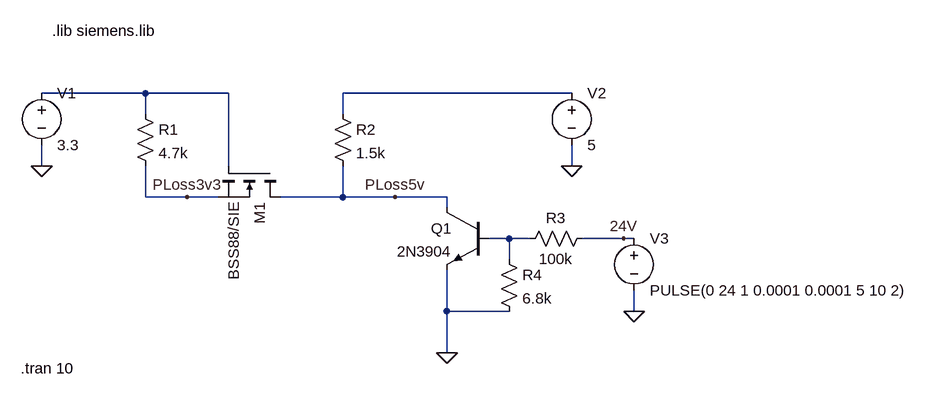
[diagram p0: schematic LevelShifter.asc]
LevelShifter.asc, the LTspice schematic file:
Version 4
SHEET 1 1572 680
WIRE -128 0 -288 0
WIRE 0 0 -128 0
WIRE 528 0 176 0
WIRE -128 32 -128 0
WIRE 176 32 176 0
WIRE -288 112 -288 80
WIRE 0 112 0 0
WIRE 528 112 528 80
WIRE -128 160 -128 112
WIRE -64 160 -128 160
WIRE -16 160 -64 160
WIRE 176 160 176 112
WIRE 176 160 80 160
WIRE 256 160 176 160
WIRE 336 160 256 160
WIRE 336 176 336 160
WIRE 432 224 400 224
WIRE 464 224 432 224
WIRE 608 224 544 224
WIRE 624 224 608 224
WIRE 432 256 432 224
WIRE 336 336 336 272
WIRE 432 336 336 336
WIRE 624 336 624 304
WIRE 336 400 336 336
FLAG 336 400 0
FLAG -288 112 0
FLAG 528 112 0
FLAG 624 336 0
FLAG -64 160 PLoss3v3
FLAG 256 160 PLoss5v
FLAG 608 224 24V
SYMBOL voltage -288 -16 R0
WINDOW 123 0 0 Left 0
WINDOW 39 0 0 Left 0
SYMATTR InstName V1
SYMATTR Value 3.3
SYMBOL voltage 528 -16 R0
WINDOW 123 0 0 Left 0
WINDOW 39 0 0 Left 0
SYMATTR InstName V2
SYMATTR Value 5
SYMBOL voltage 624 208 R0
WINDOW 123 0 0 Left 0
WINDOW 39 0 0 Left 0
SYMATTR InstName V3
SYMATTR Value PULSE(0 24 1 0.0001 0.0001 5 10 2)
SYMBOL npn 400 176 M0
SYMATTR InstName Q1
SYMATTR Value 2N3904
SYMBOL res -144 16 R0
SYMATTR InstName R1
SYMATTR Value 4.7k
SYMBOL res 160 16 R0
SYMATTR InstName R2
SYMATTR Value 1.5k
SYMBOL res 560 208 R90
WINDOW 0 0 56 VBottom 2
WINDOW 3 32 56 VTop 2
SYMATTR InstName R3
SYMATTR Value 100k
SYMBOL res 416 240 R0
SYMATTR InstName R4
SYMATTR Value 6.8k
SYMBOL nmos 80 112 R90
SYMATTR InstName M1
SYMATTR Value BSS88/SIE
SYMATTR Prefix X
TEXT -320 424 Left 2 !.tran 10
TEXT -272 -96 Left 2 !.lib siemens.lib

The netlist it stands for:
* LevelShifter.asc
V1 N001 0 3.3
V2 N002 0 5
V3 24V 0 PULSE(0 24 1 0.0001 0.0001 5 10 2)
Q1 PLoss5v N003 0 0 2N3904
R1 N001 PLoss3v3 4.7k
R2 N002 PLoss5v 1.5k
R3 24V N003 100k
R4 N003 0 6.8k
XM1 PLoss5v N001 PLoss3v3 BSS88/SIE  ; pins D G S
.model NPN NPN
.model PNP PNP
.lib standard.bjt
.tran 10
.lib siemens.lib
.backanno
.end